# EasyEDA schematic Arse LFR.json
TITLE: Sheet_1; REV: 1.0; Date: 2024-06-02; Sheet: 1/1; Company: Your Company
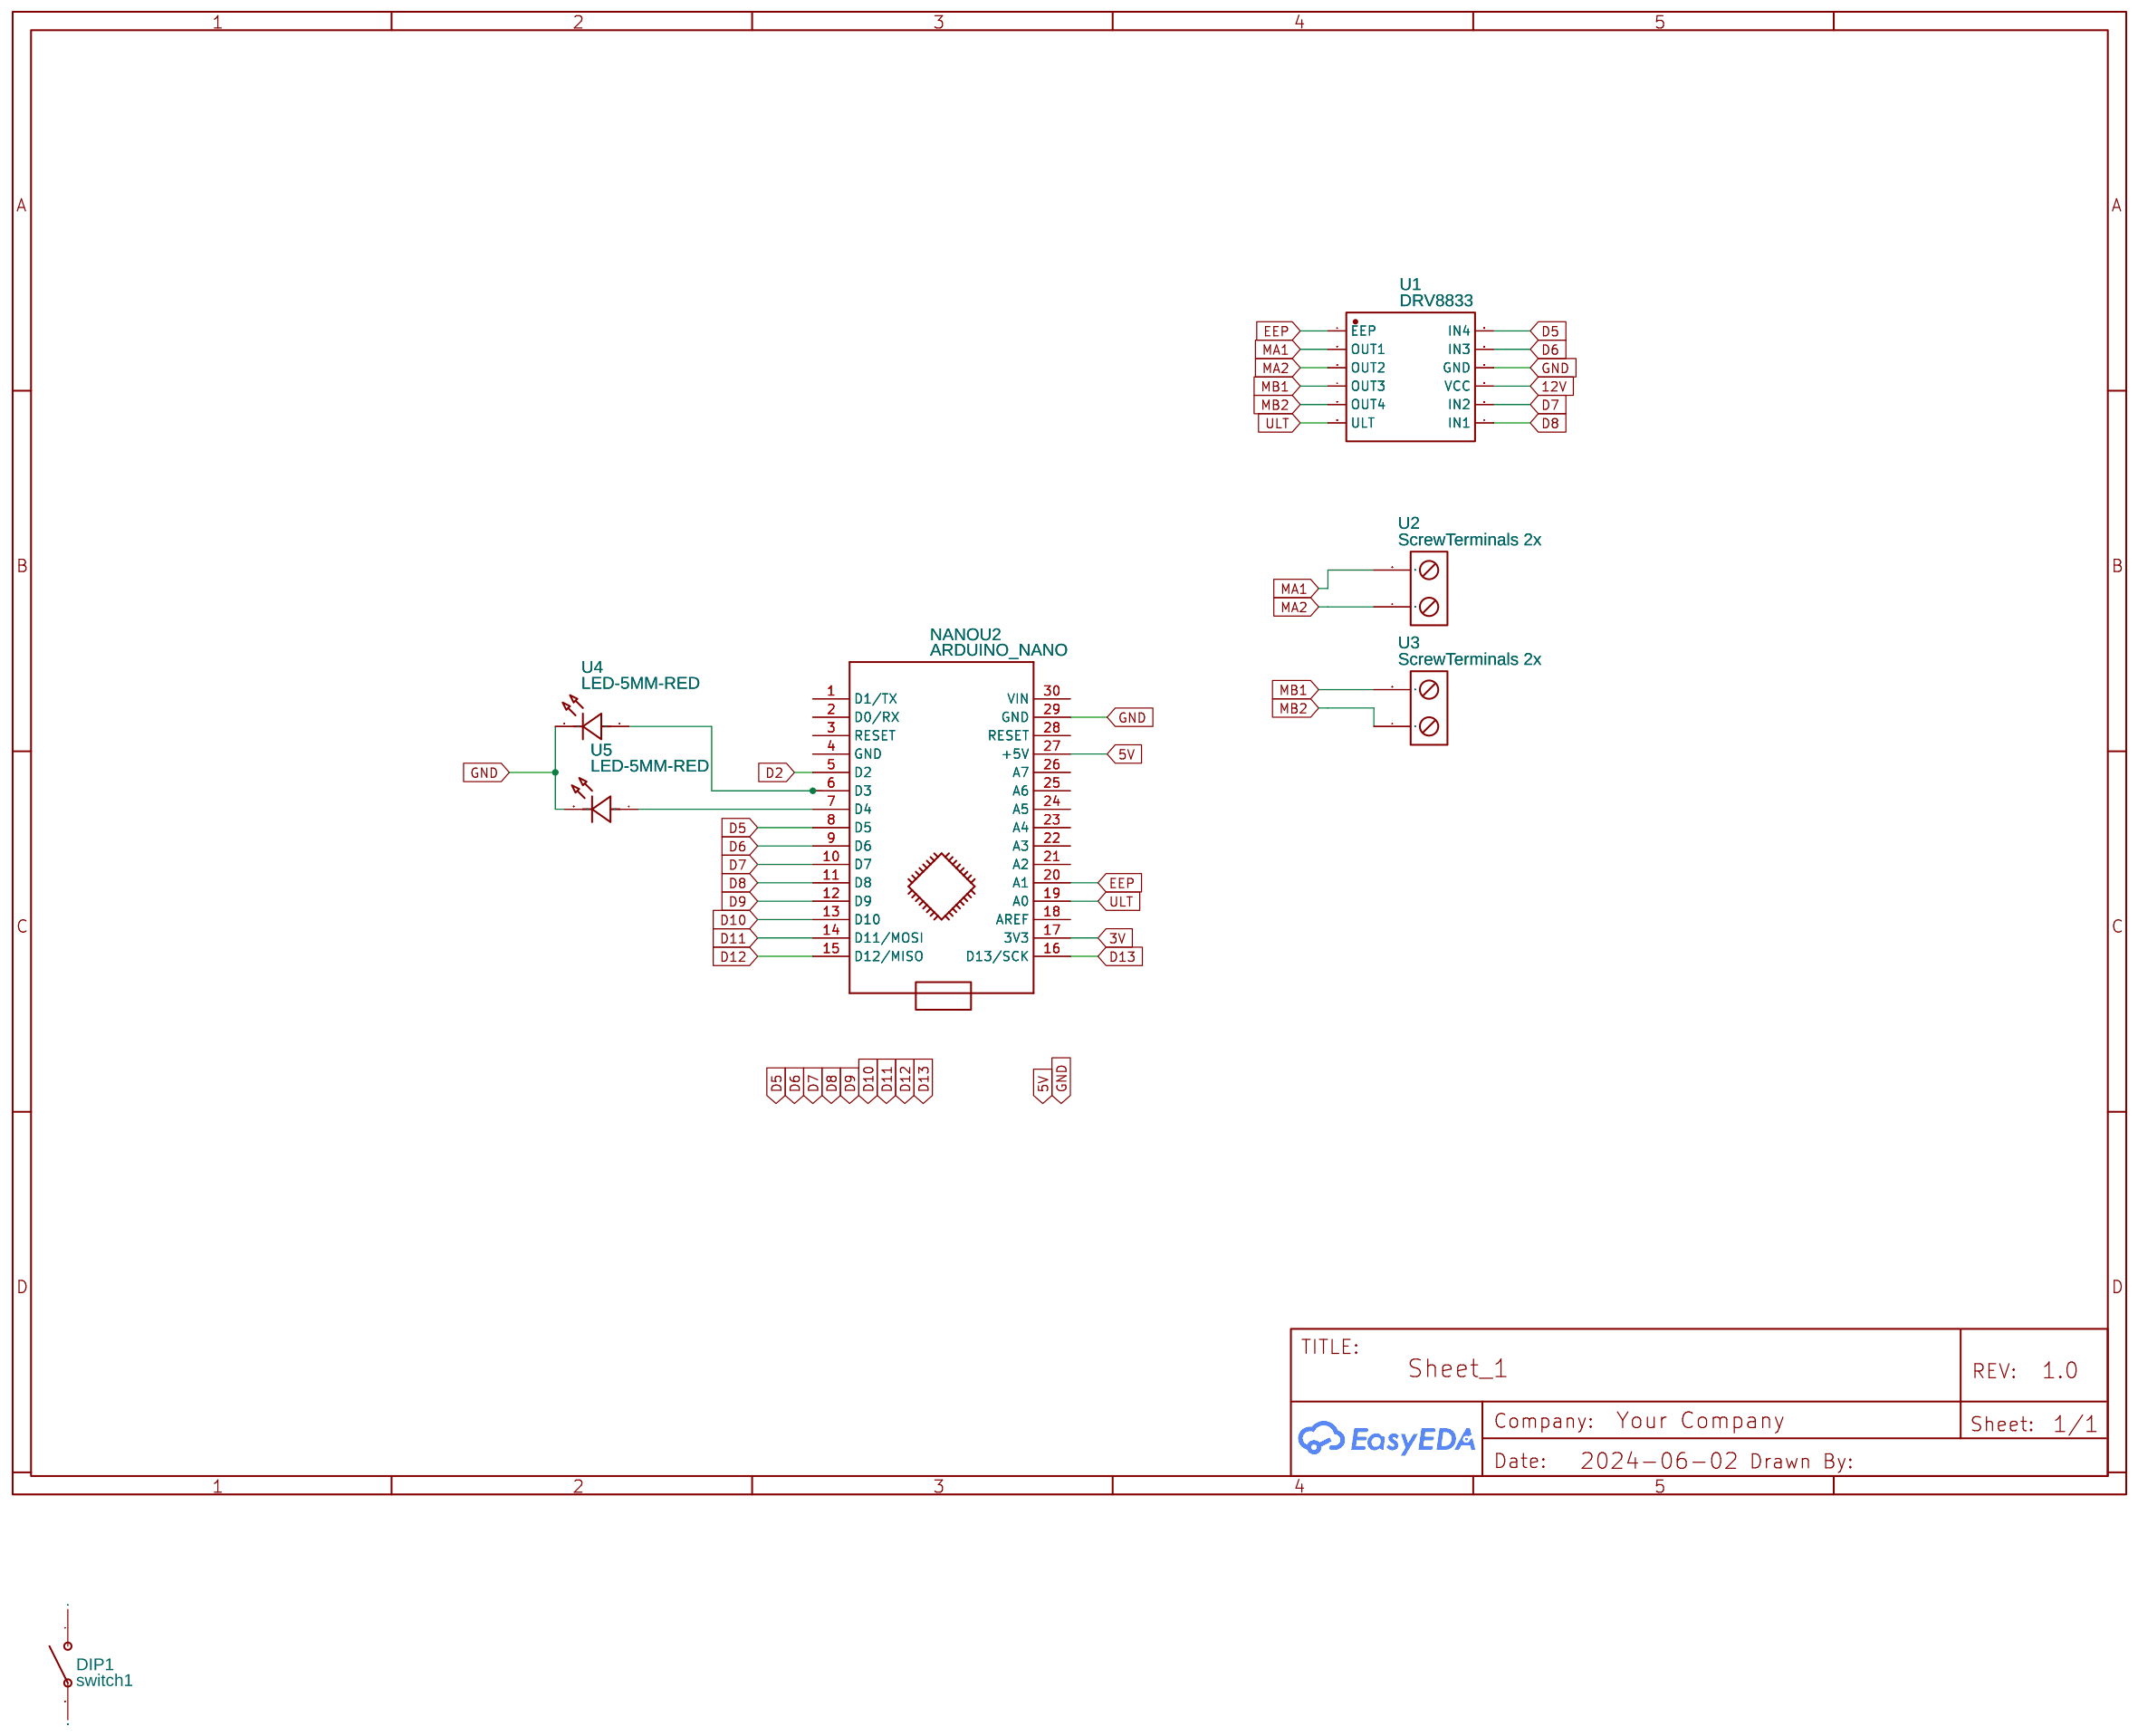
[diagram p0: schematic sheet]

## Parts
DIP1  switch1  [DIP SWITCH 6 SWITCHES]
NANOU2  ARDUINO_NANO  [ARDUINO_NANO_T]
U1  DRV8833  [PICO]
U2  ScrewTerminals 2x  [SCREW_TERMINALS 2X]
U3  ScrewTerminals 2x  [SCREW_TERMINALS 2X]
U4  LED-5MM-RED  [LED-5MM-RED]
U5  LED-5MM-RED  [LED-5MM-RED]

## Library data of the parts
DIP1 = switch1: Manufacturer: DIP; Manufacturer Part: DIP switchEI-08; Supplier Part: C90019; Contributor: nataliafrias; libConvert: Yes; Add into BOM: Yes
NANOU2 = -: sourceId: KGSeAWhDB; Manufacturer Part: ?
U1 = DRV8833: catid: 20; Contributor: labixiaoxin12345; Supplier: M5 Stack; sim: true
U2 U3 = ScrewTerminals 2x: Contributor: Gereon99
U4 U5 = LED-5MM-RED: Contributor: ford44; Supplier: LCSC; Supplier Part: C2900262; Manufacturer: OSRAM(欧司朗); Manufacturer Part: SFH 313 FA

## Nets
3V: NANOU2.17(3V3)
5V: NANOU2.27(+5V)
12V: U1.9(VCC)
GND: NANOU2.29(GND) U1.10(GND) U4.2(K) U5.2(K)
D2: NANOU2.5(D2)
D5: NANOU2.8(D5) U1.12(IN4)
D6: NANOU2.9(D6) U1.11(IN3)
D7: NANOU2.10(D7) U1.8(IN2)
D8: NANOU2.11(D8) U1.7(IN1)
D9: NANOU2.12(D9)
D10: NANOU2.13(D10)
D11: NANOU2.14(D11/MOSI)
D12: NANOU2.15(D12/MISO)
D13: NANOU2.16(D13/SCK)
EEP: NANOU2.20(A1) U1.1(EEP)
MA1: U1.2(OUT1) U2.2
MA2: U1.3(OUT2) U2.1
MB1: U1.4(OUT3) U3.2
MB2: U1.5(OUT4) U3.1
ULT: NANOU2.19(A0) U1.6(ULT)
Net-(NANOU2-6): NANOU2.6(D3) U4.1(A)
Net-(NANOU2-7): NANOU2.7(D4) U5.1(A)

Not connected (* = marked no-connect by the designer): DIP1 1 2; NANOU2 1(D1/TX) 2(D0/RX) 3(RESET) 4(GND) 18(AREF) 21(A2) 22(A3) 23(A4) 24(A5) 25(A6) 26(A7) 28(RESET) 30(VIN)
